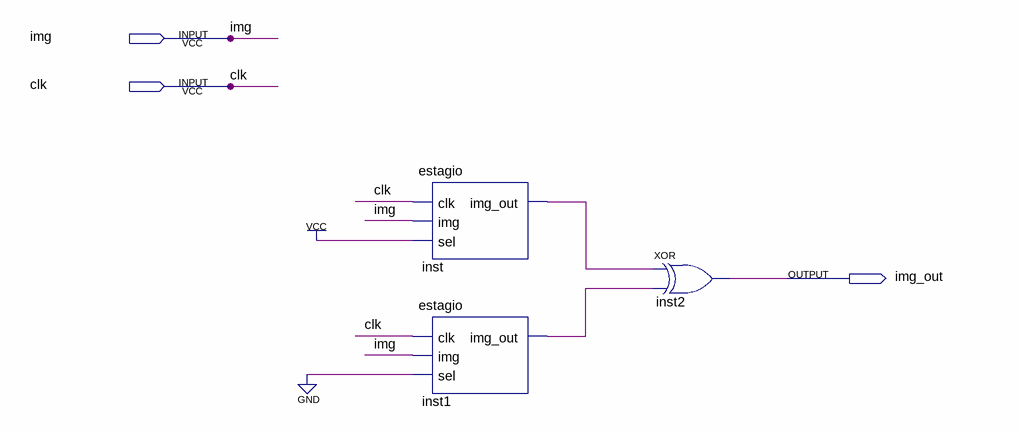
[diagram p0: schematic sheet]
// Quartus schematic bordas.bdf as structural Verilog: 3 symbols, 3 pins
module bordas (
  input  img,
  input  clk,
  output img_out
);

  wire inst1_img_out, inst_img_out;

  estagio inst (.clk(clk), .img(img), .sel(1'b1), .img_out(inst_img_out));
  estagio inst1 (.clk(clk), .img(img), .sel(1'b0), .img_out(inst1_img_out));
  xor inst2 (img_out, inst_img_out, inst1_img_out);
endmodule
